# Altium schematic sheet Bank_12_14_35.SchDoc: Kasli-DIOT
size 420 x 297 mm; EDA_Number: ARTIQ; Projet: ARTIQ/SINARA; Author: G.Kasprowicz; CompanyName: WUT ISE; DrawnBy: F.Świtakowski; Organization: WUT ISE; Address1: PW ISE; Address2: Nowowiejska 15/19 00-665 Warsaw; Address3: gkasprow@gmail.com; DocumentNumber: 12; SheetNumber: 15; SheetTotal: 16; ModifiedBy: -; CheckedDate: -; Title2: Bank 12 14 35; DivGrp: WUT ISE; Designer: F.Świtakowski; ModifiedDate: -; ProjectName: Sensor Box
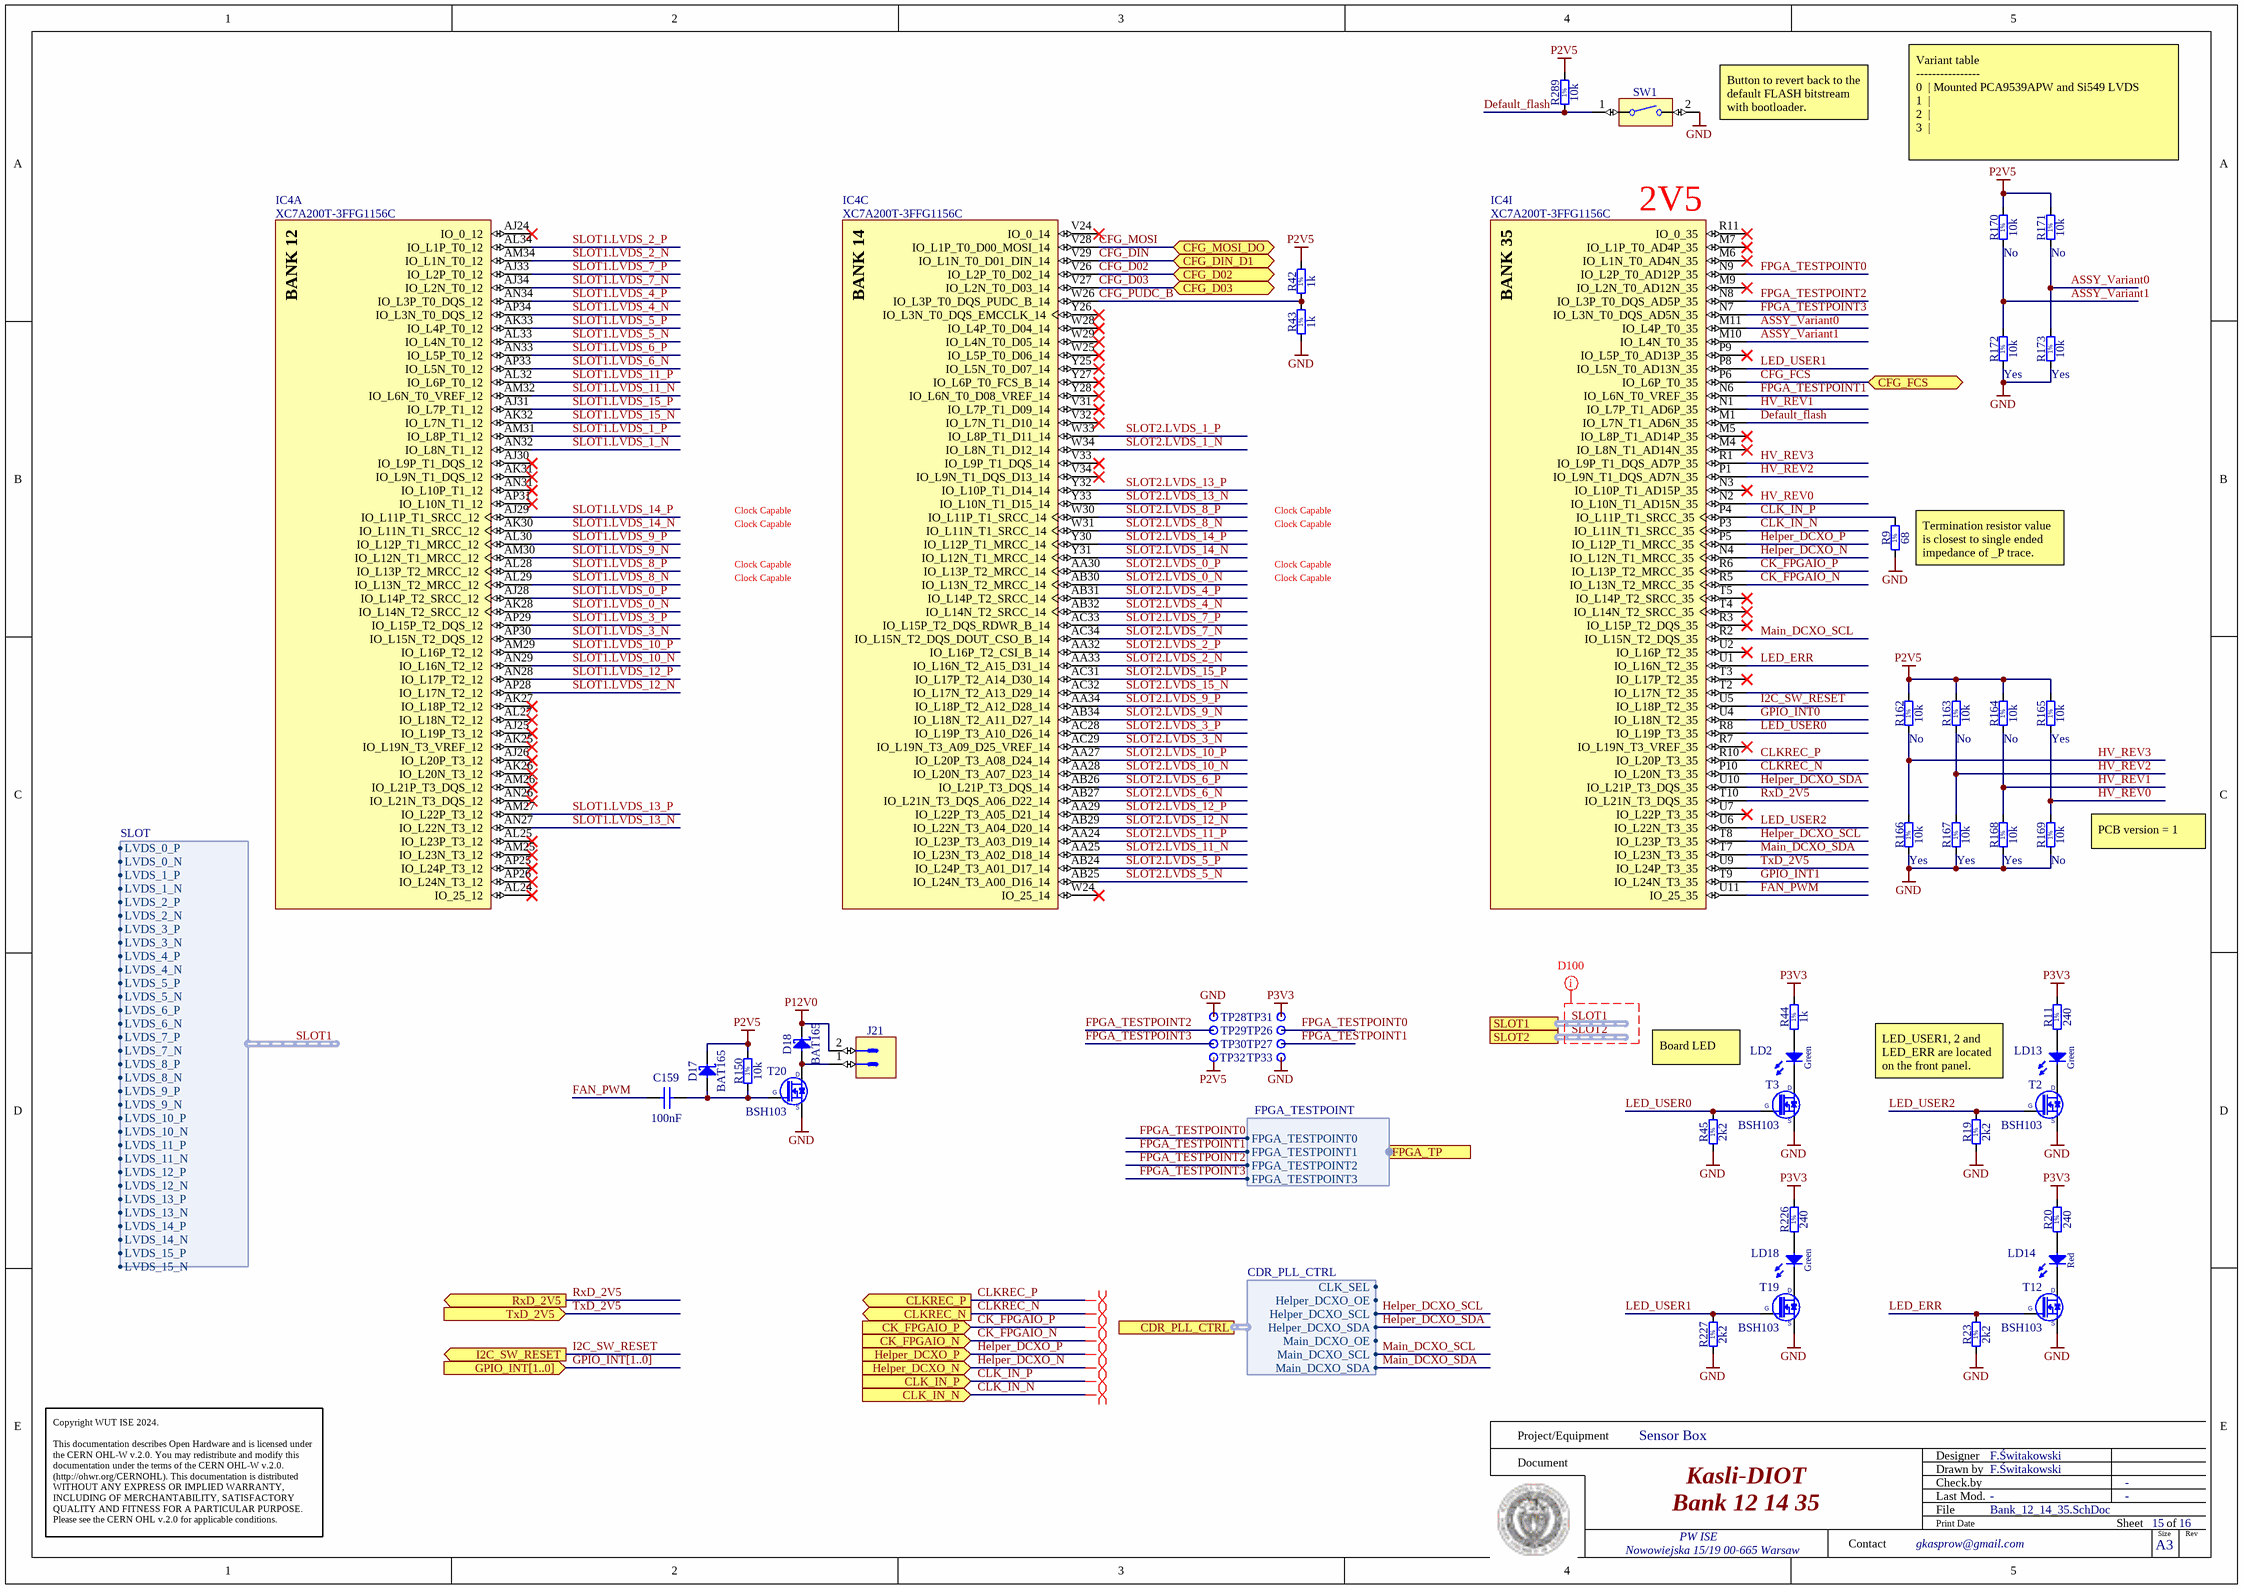
[diagram p0: Bank_12_14_35.SchDoc]

## Parts
C159  100nF  [CAPC0603X33N]
D17  BAT165  [SOD2512X110N]
D18  BAT165  [SOD2512X110N]
IC4  XC7A200T-3FFG1156C  [BGA1156C100P34X34_3500X3500X310]  (parts A,C,I of 18)
J21  KK®  [MOLEX_22-27-2021]  (value not drawn)
LD2  Green  [LED_KINGBRIGHT_KPH-1608CGCK]
LD13  Green  [LED_AVAGO_HSME-C120]
LD14  Red  [LED_AVAGO_HSMC-C120]
LD18  Green  [LED_AVAGO_HSME-C120]
R9  68  [RESC1005X40N]
R11  240  [RESC1005X40N]
R19  2k2  [RESC1005X40N]
R20  240  [RESC1005X40N]
R23  2k2  [RESC1005X40N]
R42  1k  [RESC1005X40N]
R43  1k  [RESC1005X40N]
R44  1k  [RESC1005X40N]
R45  2k2  [RESC1005X40N]
R150  10k  [RESC1005X40N]
R162  10k  Mounted: No  [RESC1005X40N]
R163  10k  Mounted: No  [RESC1005X40N]
R164  10k  Mounted: No  [RESC1005X40N]
R165  10k  Mounted: Yes  [RESC1005X40N]
R166  10k  Mounted: Yes  [RESC1005X40N]
R167  10k  Mounted: Yes  [RESC1005X40N]
R168  10k  Mounted: Yes  [RESC1005X40N]
R169  10k  Mounted: No  [RESC1005X40N]
R170  10k  Mounted: No  [RESC1005X40N]
R171  10k  Mounted: No  [RESC1005X40N]
R172  10k  Mounted: Yes  [RESC1005X40N]
R173  10k  Mounted: Yes  [RESC1005X40N]
R226  240  [RESC1005X40N]
R227  2k2  [RESC1005X40N]
R289  10k  [RESC1005X40N]
SW1  Switch  [SW_OMRON_B3U-3000PM]  (value not drawn)
T2  BSH103  [SOT95P230X110-3N]
T3  BSH103  [SOT95P230X110-3N]
T12  BSH103  [SOT95P230X110-3N]
T19  BSH103  [SOT95P230X110-3N]
T20  BSH103  [SOT95P230X110-3N]
TP26  Plated Hole  [c170h100]  (value not drawn)  (no BOM)
TP27  Plated Hole  [c170h100]  (value not drawn)  (no BOM)
TP28  Plated Hole  [c170h100]  (value not drawn)  (no BOM)
TP29  Plated Hole  [c170h100]  (value not drawn)  (no BOM)
TP30  Plated Hole  [c170h100]  (value not drawn)  (no BOM)
TP31  Plated Hole  [c170h100]  (value not drawn)  (no BOM)
TP32  Plated Hole  [c170h100]  (value not drawn)  (no BOM)
TP33  Plated Hole  [c170h100]  (value not drawn)  (no BOM)

## Ports
CDR_PLL_CTRL (harness CDR_PLL_CTRL), CFG_D02 (bidir), CFG_D03 (bidir), CFG_DIN_D1 (bidir), CFG_FCS (bidir), CFG_MOSI_DO (bidir), CK_FPGAIO_N (in), CK_FPGAIO_P (in), CLK_IN_N (in), CLK_IN_P (in), CLKREC_N (out), CLKREC_P (out), FPGA_TP (harness FPGA_TESTPOINT), GPIO_INT[1..0] (in), Helper_DCXO_N (in), Helper_DCXO_P (in), I2C_SW_RESET (out), RxD_2V5 (out), SLOT1 (harness SLOT), SLOT2 (harness SLOT), TxD_2V5 (in)

## Harnesses
CDR_PLL_CTRL: CLK_SEL, Helper_DCXO_OE, Helper_DCXO_SCL, Helper_DCXO_SDA, Main_DCXO_OE, Main_DCXO_SCL, Main_DCXO_SDA
SLOT: LVDS_0_P, LVDS_0_N, LVDS_1_P, LVDS_1_N, LVDS_2_P, LVDS_2_N, LVDS_3_P, LVDS_3_N, LVDS_4_P, LVDS_4_N, LVDS_5_P, LVDS_5_N, LVDS_6_P, LVDS_6_N, LVDS_7_P, LVDS_7_N, LVDS_8_P, LVDS_8_N, LVDS_9_P, LVDS_9_N, LVDS_10_P, LVDS_10_N, LVDS_11_P, LVDS_11_N, LVDS_12_P, LVDS_12_N, LVDS_13_P, LVDS_13_N, LVDS_14_P, LVDS_14_N, LVDS_15_P, LVDS_15_N
FPGA_TESTPOINT: FPGA_TESTPOINT0, FPGA_TESTPOINT1, FPGA_TESTPOINT2, FPGA_TESTPOINT3

## Nets
GND: R9.1 R19.1 R23.1 R43.1 R45.1 R166.1 R167.1 R168.1 R169.1 R172.1 R173.1 R227.1 SW1.2 T2.2(S) T3.2(S) T12.2(S) T19.2(S) T20.2(S) TP28.1 TP33.1
P2V5: D17.1(C) R42.2 R150.2 R162.2 R163.2 R164.2 R165.2 R170.2 R171.2 R289.2 TP32.1
P3V3: R11.2 R20.2 R44.2 R226.2 TP31.1
P12V0: D18.1(C) J21.2
ASSY_Variant0: IC4.M11(IO_L4P_T0_35) R171.1 R173.2
ASSY_Variant1: IC4.M10(IO_L4N_T0_35) R170.1 R172.2
CFG_D02: IC4.V26(IO_L2P_T0_D02_14) ; port CFG_D02
CFG_D03: IC4.V27(IO_L2N_T0_D03_14) ; port CFG_D03
CFG_DIN: IC4.V29(IO_L1N_T0_D01_DIN_14) ; port CFG_DIN_D1
CFG_FCS: IC4.P6(IO_L6P_T0_35) ; port CFG_FCS
CFG_MOSI: IC4.V28(IO_L1P_T0_D00_MOSI_14) ; port CFG_MOSI_DO
CFG_PUDC_B: IC4.W26(IO_L3P_T0_DQS_PUDC_B_14) R42.1 R43.2
CK_FPGAIO_N: IC4.R5(IO_L13N_T2_MRCC_35) ; port CK_FPGAIO_N
CK_FPGAIO_P: IC4.R6(IO_L13P_T2_MRCC_35) ; port CK_FPGAIO_P
CLK_IN_N: IC4.P3(IO_L11N_T1_SRCC_35) ; port CLK_IN_N
CLK_IN_P: IC4.P4(IO_L11P_T1_SRCC_35) R9.2 ; port CLK_IN_P
CLKREC_N: IC4.P10(IO_L20N_T3_35) ; port CLKREC_N
CLKREC_P: IC4.R10(IO_L20P_T3_35) ; port CLKREC_P
Default_flash: IC4.M1(IO_L7N_T1_AD6N_35) R289.1 SW1.1
FAN_PWM: C159.2 IC4.U11(IO_25_35)
FPGA_TESTPOINT0: IC4.N9(IO_L2P_T0_AD12P_35) TP26.1 ; port FPGA_TP.FPGA_TESTPOINT0
FPGA_TESTPOINT1: IC4.N6(IO_L6N_T0_VREF_35) TP27.1 ; port FPGA_TP.FPGA_TESTPOINT1
FPGA_TESTPOINT2: IC4.N8(IO_L3P_T0_DQS_AD5P_35) TP29.1 ; port FPGA_TP.FPGA_TESTPOINT2
FPGA_TESTPOINT3: IC4.N7(IO_L3N_T0_DQS_AD5N_35) TP30.1 ; port FPGA_TP.FPGA_TESTPOINT3
GPIO_INT0: IC4.U4(IO_L18N_T2_35)
GPIO_INT1: IC4.T9(IO_L24N_T3_35)
Helper_DCXO_N: IC4.N4(IO_L12N_T1_MRCC_35) ; port Helper_DCXO_N
Helper_DCXO_P: IC4.P5(IO_L12P_T1_MRCC_35) ; port Helper_DCXO_P
Helper_DCXO_SCL: IC4.T8(IO_L23P_T3_35) ; port CDR_PLL_CTRL.Helper_DCXO_SCL
Helper_DCXO_SDA: IC4.U10(IO_L21P_T3_DQS_35) ; port CDR_PLL_CTRL.Helper_DCXO_SDA
HV_REV0: IC4.N2(IO_L10N_T1_AD15N_35) R165.1 R169.2
HV_REV1: IC4.N1(IO_L7P_T1_AD6P_35) R164.1 R168.2
HV_REV2: IC4.P1(IO_L9N_T1_DQS_AD7N_35) R163.1 R167.2
HV_REV3: IC4.R1(IO_L9P_T1_DQS_AD7P_35) R162.1 R166.2
I2C_SW_RESET: IC4.U5(IO_L18P_T2_35) ; port I2C_SW_RESET
LED_ERR: IC4.U1(IO_L16N_T2_35) R23.2 T12.1(G)
LED_USER0: IC4.R8(IO_L19P_T3_35) R45.2 T3.1(G)
LED_USER1: IC4.P8(IO_L5N_T0_AD13N_35) R227.2 T19.1(G)
LED_USER2: IC4.U6(IO_L22N_T3_35) R19.2 T2.1(G)
Main_DCXO_SCL: IC4.R2(IO_L15N_T2_DQS_35) ; port CDR_PLL_CTRL.Main_DCXO_SCL
Main_DCXO_SDA: IC4.T7(IO_L23N_T3_35) ; port CDR_PLL_CTRL.Main_DCXO_SDA
RxD_2V5: IC4.T10(IO_L21N_T3_DQS_35) ; port RxD_2V5
SLOT1.LVDS_0_N: IC4.AK28(IO_L14N_T2_SRCC_12)
SLOT1.LVDS_0_P: IC4.AJ28(IO_L14P_T2_SRCC_12)
SLOT1.LVDS_1_N: IC4.AN32(IO_L8N_T1_12)
SLOT1.LVDS_1_P: IC4.AM31(IO_L8P_T1_12)
SLOT1.LVDS_2_N: IC4.AM34(IO_L1N_T0_12)
SLOT1.LVDS_2_P: IC4.AL34(IO_L1P_T0_12)
SLOT1.LVDS_3_N: IC4.AP30(IO_L15N_T2_DQS_12)
SLOT1.LVDS_3_P: IC4.AP29(IO_L15P_T2_DQS_12)
SLOT1.LVDS_4_N: IC4.AP34(IO_L3N_T0_DQS_12)
SLOT1.LVDS_4_P: IC4.AN34(IO_L3P_T0_DQS_12)
SLOT1.LVDS_5_N: IC4.AL33(IO_L4N_T0_12)
SLOT1.LVDS_5_P: IC4.AK33(IO_L4P_T0_12)
SLOT1.LVDS_6_N: IC4.AP33(IO_L5N_T0_12)
SLOT1.LVDS_6_P: IC4.AN33(IO_L5P_T0_12)
SLOT1.LVDS_7_N: IC4.AJ34(IO_L2N_T0_12)
SLOT1.LVDS_7_P: IC4.AJ33(IO_L2P_T0_12)
SLOT1.LVDS_8_N: IC4.AL29(IO_L13N_T2_MRCC_12)
SLOT1.LVDS_8_P: IC4.AL28(IO_L13P_T2_MRCC_12)
SLOT1.LVDS_9_N: IC4.AM30(IO_L12N_T1_MRCC_12)
SLOT1.LVDS_9_P: IC4.AL30(IO_L12P_T1_MRCC_12)
SLOT1.LVDS_10_N: IC4.AN29(IO_L16N_T2_12)
SLOT1.LVDS_10_P: IC4.AM29(IO_L16P_T2_12)
SLOT1.LVDS_11_N: IC4.AM32(IO_L6N_T0_VREF_12)
SLOT1.LVDS_11_P: IC4.AL32(IO_L6P_T0_12)
SLOT1.LVDS_12_N: IC4.AP28(IO_L17N_T2_12)
SLOT1.LVDS_12_P: IC4.AN28(IO_L17P_T2_12)
SLOT1.LVDS_13_N: IC4.AN27(IO_L22N_T3_12)
SLOT1.LVDS_13_P: IC4.AM27(IO_L22P_T3_12)
SLOT1.LVDS_14_N: IC4.AK30(IO_L11N_T1_SRCC_12)
SLOT1.LVDS_14_P: IC4.AJ29(IO_L11P_T1_SRCC_12)
SLOT1.LVDS_15_N: IC4.AK32(IO_L7N_T1_12)
SLOT1.LVDS_15_P: IC4.AJ31(IO_L7P_T1_12)
SLOT2.LVDS_0_N: IC4.AB30(IO_L13N_T2_MRCC_14)
SLOT2.LVDS_0_P: IC4.AA30(IO_L13P_T2_MRCC_14)
SLOT2.LVDS_1_N: IC4.W34(IO_L8N_T1_D12_14)
SLOT2.LVDS_1_P: IC4.W33(IO_L8P_T1_D11_14)
SLOT2.LVDS_2_N: IC4.AA33(IO_L16N_T2_A15_D31_14)
SLOT2.LVDS_2_P: IC4.AA32(IO_L16P_T2_CSI_B_14)
SLOT2.LVDS_3_N: IC4.AC29(IO_L19N_T3_A09_D25_VREF_14)
SLOT2.LVDS_3_P: IC4.AC28(IO_L19P_T3_A10_D26_14)
SLOT2.LVDS_4_N: IC4.AB32(IO_L14N_T2_SRCC_14)
SLOT2.LVDS_4_P: IC4.AB31(IO_L14P_T2_SRCC_14)
SLOT2.LVDS_5_N: IC4.AB25(IO_L24N_T3_A00_D16_14)
SLOT2.LVDS_5_P: IC4.AB24(IO_L24P_T3_A01_D17_14)
SLOT2.LVDS_6_N: IC4.AB27(IO_L21N_T3_DQS_A06_D22_14)
SLOT2.LVDS_6_P: IC4.AB26(IO_L21P_T3_DQS_14)
SLOT2.LVDS_7_N: IC4.AC34(IO_L15N_T2_DQS_DOUT_CSO_B_14)
SLOT2.LVDS_7_P: IC4.AC33(IO_L15P_T2_DQS_RDWR_B_14)
SLOT2.LVDS_8_N: IC4.W31(IO_L11N_T1_SRCC_14)
SLOT2.LVDS_8_P: IC4.W30(IO_L11P_T1_SRCC_14)
SLOT2.LVDS_9_N: IC4.AB34(IO_L18N_T2_A11_D27_14)
SLOT2.LVDS_9_P: IC4.AA34(IO_L18P_T2_A12_D28_14)
SLOT2.LVDS_10_N: IC4.AA28(IO_L20N_T3_A07_D23_14)
SLOT2.LVDS_10_P: IC4.AA27(IO_L20P_T3_A08_D24_14)
SLOT2.LVDS_11_N: IC4.AA25(IO_L23N_T3_A02_D18_14)
SLOT2.LVDS_11_P: IC4.AA24(IO_L23P_T3_A03_D19_14)
SLOT2.LVDS_12_N: IC4.AB29(IO_L22N_T3_A04_D20_14)
SLOT2.LVDS_12_P: IC4.AA29(IO_L22P_T3_A05_D21_14)
SLOT2.LVDS_13_N: IC4.Y33(IO_L10N_T1_D15_14)
SLOT2.LVDS_13_P: IC4.Y32(IO_L10P_T1_D14_14)
SLOT2.LVDS_14_N: IC4.Y31(IO_L12N_T1_MRCC_14)
SLOT2.LVDS_14_P: IC4.Y30(IO_L12P_T1_MRCC_14)
SLOT2.LVDS_15_N: IC4.AC32(IO_L17N_T2_A13_D29_14)
SLOT2.LVDS_15_P: IC4.AC31(IO_L17P_T2_A14_D30_14)
TxD_2V5: IC4.U9(IO_L24P_T3_35) ; port TxD_2V5
NetC159_1: C159.1 D17.2(A) R150.1 T20.1(G)
NetD18_2: D18.2(A) J21.1 T20.3(D)
NetLD2_1: LD2.1(C) T3.3(D)
NetLD2_2: LD2.2(A) R44.1
NetLD13_1: LD13.1(C) T2.3(D)
NetLD13_2: LD13.2(A) R11.1
NetLD14_1: LD14.1(C) T12.3(D)
NetLD14_2: LD14.2(A) R20.1
NetLD18_1: LD18.1(C) T19.3(D)
NetLD18_2: LD18.2(A) R226.1

Not connected (* = marked no-connect by the designer): IC4 AJ24(IO_0_12)* AJ25(IO_L19P_T3_12)* AJ26(IO_L20P_T3_12)* AJ30(IO_L9P_T1_DQS_12)* AK25(IO_L19N_T3_VREF_12)* AK26(IO_L20N_T3_12)* AK27(IO_L18P_T2_12)* AK31(IO_L9N_T1_DQS_12)* AL24(IO_25_12)* AL25(IO_L23P_T3_12)* AL27(IO_L18N_T2_12)* AM25(IO_L23N_T3_12)* AM26(IO_L21P_T3_DQS_12)* AN26(IO_L21N_T3_DQS_12)* AN31(IO_L10P_T1_12)* AP25(IO_L24P_T3_12)* AP26(IO_L24N_T3_12)* AP31(IO_L10N_T1_12)* M4(IO_L8N_T1_AD14N_35)* M5(IO_L8P_T1_AD14P_35)* M6(IO_L1N_T0_AD4N_35)* M7(IO_L1P_T0_AD4P_35)* M9(IO_L2N_T0_AD12N_35)* N3(IO_L10P_T1_AD15P_35)* P9(IO_L5P_T0_AD13P_35)* R3(IO_L15P_T2_DQS_35)* R7(IO_L19N_T3_VREF_35)* R11(IO_0_35)* T2(IO_L17N_T2_35) T3(IO_L17P_T2_35)* T4(IO_L14N_T2_SRCC_35)* T5(IO_L14P_T2_SRCC_35)* U2(IO_L16P_T2_35)* U7(IO_L22P_T3_35)* V24(IO_0_14)* V31(IO_L7P_T1_D09_14)* V32(IO_L7N_T1_D10_14)* V33(IO_L9P_T1_DQS_14)* V34(IO_L9N_T1_DQS_D13_14)* W24(IO_25_14)* W25(IO_L5P_T0_D06_14)* W28(IO_L4P_T0_D04_14)* W29(IO_L4N_T0_D05_14)* Y25(IO_L5N_T0_D07_14)* Y26(IO_L3N_T0_DQS_EMCCLK_14)* Y27(IO_L6P_T0_FCS_B_14)* Y28(IO_L6N_T0_D08_VREF_14)*

## Buses and harness runs
bus GPIO_INT[1..0] = port GPIO_INT[1..0]
harness SLOT1 = port SLOT1
harness SLOT2 = port SLOT2

## Layout directives
differential pair: CK_FPGAIO_N, CK_FPGAIO_P, CLK_IN_N, CLK_IN_P, CLKREC_N, CLKREC_P, Helper_DCXO_N, Helper_DCXO_P
net class D100: SLOT1, SLOT2

## Notes on the sheet
- (near SW1) Button to revert back to the default FLASH bitstream with bootloader.
- Variant table
  ----------------
  0  | Mounted PCA9539APW and Si549 LVDS
  1  |
  2  |
  3  |
- (near IC4) 2V5
- Clock Capable
- (near R9) Termination resistor value is closest to single ended impedance of _P trace.
- (near R169) PCB version = 1
- Board LED
- LED_USER1, 2 and LED_ERR are located on the front panel.
- Project/Equipment
- Document
- Designer
- Drawn by
- Check.by
- Copyright WUT ISE 2024.
  This documentation describes Open Hardware and is licensed under the CERN OHL-W v.2.0. You may redistribute and modify this documentation under the terms of the CERN OHL-W v.2.0. (http://ohwr.org/CERNOHL). This documentation is distributed WITHOUT ANY EXPRESS OR IMPLIED WARRANTY, INCLUDING OF MERCHANTABILITY, SATISFACTORY QUALITY AND FITNESS FOR A PARTICULAR PURPOSE. Please see the CERN OHL v.2.0 for applicable conditions.
- Contact
- File
- Last Mod.
- Print Date
- Sheet
- Size
- A3
- of
- Rev
- (in symbol R0402_1K_1%_0.0625W_100PPM) 1%
- (in symbol R0402_1k_1%_0.0625W_100PPM) 1%
- (in symbol R0402_2K2_1%_0.0625W_100PPM) 1%
- (in symbol R0402_10k_1%_0.0625W_100PPM) 1%
- (in symbol R0402_68R_1%_0.0625W_100PPM) 1%
- (in symbol R0402_240R_1%_0.0625W_100PPM) 1%
- (in symbol XC7A200T-3FFG1156C, part A) BANK 12
- (in symbol XC7A200T-3FFG1156C, part C) BANK 14
- (in symbol XC7A200T-3FFG1156C, part I) BANK 35

## Library data of the parts
C159 = CC0201_100NF_6.3V_10%_X5R: Non-polarised capacitor; Part Description: SMD Multilayer Chip Ceramic Capacitor; Manufacturer: GENERIC; Manufacturer1 Part Number: 02016D104KAT2A; Voltage: 6.3V; TC: X5R; Tolerance: ±10%; Part Number: CC0201_100NF_6.3V_10%_X5R; Component Kind: Standard; Component Type: Standard; Pin Count: 2; Value: 100nF; Status: Not Recommended; Manufacturer Part Number: CC0201_100NF_6.3V_10%_X5R; Case: 0201; Mounted: Yes; Socket: No; SMD: Yes; Sense: No; Manufacturer1 Example: AVX; Manufacturer1 ComponentHeight: 0.33mm; HelpURL: \\cern.ch\dfs\Applications\Altium\Datasheets\CC0201_X5R_AVX.pdf; Author: CERN DEM JLC; CreateDate: 2007-12-03; LatestRevisionDate: 2007-12-03; ClassName: FPGA_JTAG
D17 D18 = BAT165: Schottky Diode; Part Description: Medium Power AF Schottky Diode; Manufacturer: INFINEON; Voltage: 40V; Power: 750mA; PressFit: No; Bonding: No; Part Number: BAT165; Component Kind: Standard; Component Type: Standard; Device: BAT165; PackageDescription: Small Outline Diode (SOD-323), 1.70mm W X 1.25mm L X 1.10mm H body,  IPC Medium Density; Manufacturer Part Number: BAT165; Pin Count: 2; Case: SOD323; Mounted: Yes; Socket: No; SMD: Yes; Sense: No; ComponentHeight: 1.1mm; HelpURL: \\cern.ch\dfs\Applications\Altium\Datasheets\BAT165.pdf; Author: CERN DEM JLC; CreateDate: 12.11.2014; LatestRevisionDate: 12.11.2014
IC4 = XC7A200T-3FFG1156C: Artix-7 FPGA, 500 User I/Os, 16 GTP, 1156-Ball BGA, , Speed Grade 3, Commercial Grade, Pb-Free; Part Description: Artix-7 FPGA, 500 User I/Os, 16 GTP, 1156-Ball BGA, Speed Grade 3, Commercial Grade, Pb-Free; Manufacturer: XILINX; PressFit: No; Bonding: No; Part Number: XC7A200T-3FFG1156C; Component Kind: Standard; Component Type: Standard; Device: XC7A200T-3FFG1156C; PackageDescription: BGA, 1.00mm Pitch, Square; 1156 Pin, 34 Columns X 34 Rows, Body 35.00mm X 35.0mm X 3.10mm H, IPC Medium Density; Manufacturer Part Number: XC7A200T-3FFG1156C; Pin Count: 1156; Case: BGA1156; Mounted: Yes; Socket: No; SMD: Yes; Sense: No; ComponentHeight: 3.1mm; HelpURL: \\cern.ch\dfs\Applications\Altium\Datasheets\XC7A200T-3FFG1156C.pdf; ComponentLink1URL: \\cern.ch\dfs\Applications\Altium\Datasheets\XC7A200T-3FFG1156C_Package.pdf; ComponentLink1Description: Package; ComponentLink2URL: \\cern.ch\dfs\Applications\Altium\Datasheets\XC7A200T-3FFG1156C_Pinout.txt; ComponentLink2Description: Pinout; Author: CERN DEM JLC; CreateDate: 07.11.2016; LatestRevisionDate: 07.11.2016
J21 = MOLEX_22-27-2021: Connector 2 Male; Part Description: 2.54mm (.100") Pitch KK® Wire-to-Board Header, Vertical, with Friction Lock, 2 Circuits, Tin (Sn) Plating; Manufacturer: MOLEX; PressFit: No; Part Number: MOLEX_22-27-2021; Component Kind: Standard; Component Type: Standard; Pin Count: 2; Family: KK®; Mounted: Yes; Socket: No; SMD: No; Sense: No; Status: None; Manufacturer Part Number: 22-27-2021; ComponentHeight: 11.7mm; HelpURL: \\cern.ch\dfs\Applications\Altium\Datasheets\MOLEX_22-27-2021.pdf; Author: CERN DEM JLC; CreateDate: 04.12.2008; LatestRevisionDate: 04.12.2008
LD2 = LED_KINGBRIGHT_KPH-1608CGCK: LED Green 1C 2A; Part Description: SMD Green LED, Case 1.6mmX0.8mm(0603), 0.65mm Thickness; PressFit: No; Bonding: No; Manufacturer Part Number: KPH-1608CGCK; ComponentHeight: 0.65mm; HelpURL: \\cern.ch\dfs\Applications\Altium\Datasheets\LED_KINGBRIGHT_KPH-1608CGCK.pdf; Part Number: LED_KINGBRIGHT_KPH-1608CGCK; Component Kind: Standard; Component Type: Standard; Color: Green; PackageDescription: SMT Green LED, Case 0603, Body L 1.6 x W 0.8mm H 0.65mm; Manufacturer: KINGBRIGHT; Pin Count: 2; Mounted: Yes; Socket: No; SMD: Yes; Sense: No; Author: CERN DEM JLC; CreateDate: 03.07.2017; LatestRevisionDate: 03.07.2017
LD13 LD18 = LED_AVAGO_HSME-C120: LED Green 1C 2A; Part Description: High Performance Right Angle Chip Green LED; Manufacturer: AVAGO TECHNOLOGIES; PressFit: No; Bonding: No; Manufacturer Part Number: HSME-C120; ComponentHeight: 0.7mm; HelpURL: \\cern.ch\dfs\Applications\Altium\Datasheets\LED_AVAGO_HSME-C120.pdf; Part Number: LED_AVAGO_HSME-C120; Component Kind: Standard; Component Type: Standard; Color: Green; PackageDescription: Green Chip LED, 2-Leads, Body 1.7x1.1mm, Side Emitting Package; Pin Count: 2; Mounted: Yes; Socket: No; SMD: Yes; Sense: No; Author: CERN DEM JMW; CreateDate: 22.07.2009; LatestRevisionDate: 20.06.2012; ComponentLink1URL: \\cern.ch\dfs\Applications\Altium\Datasheets\LED_AVAGO_HSME-C110_DESIGN-GUIDE.pdf; ComponentLink1Description: Design Guide
LD14 = LED_AVAGO_HSMC-C120: LED Red 1C 2A; Part Description: High Performance Right Angle Chip Red LED; Manufacturer: AVAGO TECHNOLOGIES; PressFit: No; Bonding: No; Manufacturer Part Number: HSMC-C120; ComponentHeight: 0.7mm; HelpURL: \\cern.ch\dfs\Applications\Altium\Datasheets\LED_AVAGO_HSMC-C120.pdf; Part Number: LED_AVAGO_HSMC-C120; Component Kind: Standard; Component Type: Standard; Color: Red; PackageDescription: Red Chip LED, 2-Leads, Body 1.7x1.1mm, Side Emitting Package; Pin Count: 2; Mounted: Yes; Socket: No; SMD: Yes; Sense: No; Author: CERN DEM JMW; CreateDate: 2009-07-22; LatestRevisionDate: 2012-06-20; ComponentLink1URL: \\cern.ch\dfs\Applications\Altium\Datasheets\LED_AVAGO_HSMC-C120_DESIGN-GUIDE.pdf; ComponentLink1Description: Design Guide
R9 = R0402_68R_1%_0.0625W_100PPM: Resistor - 1%; Part Description: General Purpose Thick Film Chip Resistor; Manufacturer: GENERIC; Manufacturer1 Part Number: 232270676809L; TC: ±100ppm/°C; PressFit: No; Part Number: R0402_68R_1%_0.0625W_100PPM; Component Kind: Standard; Component Type: Standard; Pin Count: 2; Value: 68; Status: Not Recommended; Power: 0.0625W; Tolerance: ±1%; Manufacturer Part Number: R0402_68R_1%_0.0625W_100PPM; Case: 0402; Mounted: Yes; Sense: No; Socket: No; SMD: Yes; Manufacturer1 Example: YAGEO PHYCOMP; Manufacturer1 ComponentHeight: 0.4mm; HelpURL: \\cern.ch\dfs\Applications\Altium\Datasheets\R0402_Phycomp_RC0402.pdf; Author: CERN DEM JLC; CreateDate: 03.12.2007; LatestRevisionDate: 17.10.2012
R11 R20 R226 = R0402_240R_1%_0.0625W_100PPM: Resistor - 1%; Part Description: General Purpose Thick Film Chip Resistor; Manufacturer: GENERIC; Manufacturer1 Part Number: 232270672401L; TC: ±100ppm/°C; PressFit: No; Part Number: R0402_240R_1%_0.0625W_100PPM; Component Kind: Standard; Component Type: Standard; Pin Count: 2; Value: 240; Status: Not Recommended; Power: 0.0625W; Tolerance: ±1%; Manufacturer Part Number: R0402_240R_1%_0.0625W_100PPM; Case: 0402; Mounted: Yes; Sense: No; Socket: No; SMD: Yes; Manufacturer1 Example: YAGEO PHYCOMP; Manufacturer1 ComponentHeight: 0.4mm; HelpURL: \\cern.ch\dfs\Applications\Altium\Datasheets\R0402_Phycomp_RC0402.pdf; Author: CERN DEM JLC; CreateDate: 03.12.2007; LatestRevisionDate: 17.10.2012
R19 R23 R45 R227 = R0402_2K2_1%_0.0625W_100PPM: Resistor - 1%; Part Description: General Purpose Thick Film Chip Resistor; Manufacturer: GENERIC; Manufacturer1 Part Number: 232270672202L; TC: ±100ppm/°C; PressFit: No; Part Number: R0402_2K2_1%_0.0625W_100PPM; Component Kind: Standard; Component Type: Standard; Pin Count: 2; Value: 2k2; Status: Not Recommended; Power: 0.0625W; Tolerance: ±1%; Manufacturer Part Number: R0402_2K2_1%_0.0625W_100PPM; Case: 0402; Mounted: Yes; Sense: No; Socket: No; SMD: Yes; Manufacturer1 Example: YAGEO PHYCOMP; Manufacturer1 ComponentHeight: 0.4mm; HelpURL: \\cern.ch\dfs\Applications\Altium\Datasheets\R0402_Phycomp_RC0402.pdf; Author: CERN DEM JLC; CreateDate: 03.12.2007; LatestRevisionDate: 17.10.2012; ClassName: Artix
R42 R43 = R0402_1K_1%_0.0625W_100PPM: Resistor - 1%; Part Description: General Purpose Thick Film Chip Resistor; Manufacturer: GENERIC; Manufacturer1 Part Number: 232270671002L; TC: ±100ppm/°C; PressFit: No; Part Number: R0402_1K_1%_0.0625W_100PPM; Component Kind: Standard; Component Type: Standard; Pin Count: 2; Value: 1k; Status: Not Recommended; Power: 0.0625W; Tolerance: ±1%; Manufacturer Part Number: R0402_1K_1%_0.0625W_100PPM; Case: 0402; Mounted: Yes; Sense: No; Socket: No; SMD: Yes; Manufacturer1 Example: YAGEO PHYCOMP; Manufacturer1 ComponentHeight: 0.4mm; HelpURL: \\cern.ch\dfs\Applications\Altium\Datasheets\R0402_Phycomp_RC0402.pdf; Author: CERN DEM JLC; CreateDate: 03.12.2007; LatestRevisionDate: 17.10.2012; ClassName: Artix
R44 = R0402_1k_1%_0.0625W_100PPM: Resistor - 1%; Part Description: General Purpose Thick Film Chip Resistor; Manufacturer: GENERIC; Manufacturer1 Part Number: 232270671002L; TC: ±100ppm/°C; PressFit: No; Part Number: R0402_1K_1%_0.0625W_100PPM; Component Kind: Standard; Component Type: Standard; Pin Count: 2; Value: 1k; Status: Not Recommended; Power: 0.0625W; Tolerance: ±1%; Manufacturer Part Number: R0402_1K_1%_0.0625W_100PPM; Case: 0402; Mounted: Yes; Sense: No; Socket: No; SMD: Yes; Manufacturer1 Example: YAGEO PHYCOMP; Manufacturer1 ComponentHeight: 0.4mm; HelpURL: \\cern.ch\dfs\Applications\Altium\Datasheets\R0402_Phycomp_RC0402.pdf; Author: CERN DEM JLC; CreateDate: 03.12.2007; LatestRevisionDate: 17.10.2012; ClassName: Artix
R150 R162-R173 R289 = R0402_10k_1%_0.0625W_100PPM: Resistor - 1%; Part Description: General Purpose Thick Film Chip Resistor; Manufacturer: GENERIC; Manufacturer1 Part Number: 232270671003L; TC: ±100ppm/°C; PressFit: No; Part Number: R0402_10K_1%_0.0625W_100PPM; Component Kind: Standard; Component Type: Standard; Pin Count: 2; Value: 10k; Status: Not Recommended; Power: 0.0625W; Tolerance: ±1%; Manufacturer Part Number: R0402_10K_1%_0.0625W_100PPM; Case: 0402; Sense: No; Socket: No; SMD: Yes; Manufacturer1 Example: YAGEO PHYCOMP; Manufacturer1 ComponentHeight: 0.4mm; HelpURL: \\cern.ch\dfs\Applications\Altium\Datasheets\R0402_Phycomp_RC0402.pdf; Author: CERN DEM JLC; CreateDate: 03.12.2007; LatestRevisionDate: 17.10.2012
  R150 R289: Mounted: Yes
SW1 = SW_OMRON_B3U-3000PM: 1 Ways SPST DIP Switch; Part Description: Ultra-small Surface-mounting Tactile Switche with High Contact Reliability, Side-actuated, Contact Rating 50mA 12VDC; Manufacturer: OMRON; PressFit: No; Sense Comment: Non-washable; Part Number: SW_OMRON_B3U-3000PM; Component Kind: Standard; Component Type: Standard; Pin Count: 2; PackageDescription: Body 3.2x4.0mm, SPST Surface-Mounting Tactile Switch with Side Actuator (B3U Series); Family: Switch; Mounted: Yes; Socket: No; SMD: Yes; Sense: Yes; Status: None; Manufacturer Part Number: B3U-3000PM; ComponentHeight: 1.35mm; HelpURL: \\cern.ch\dfs\Applications\Altium\Datasheets\SW_OMRON_B3U.pdf; Author: CERN DEM HF; CreateDate: 04.10.2022; LatestRevisionDate: 04.10.2022
T2 T3 T12 T19 T20 = BSH103: N-CHANNEL MOSFET WITH DIODE; Part Description: 30V 850mA N-Channel Enhancement Mode Field-Effect Transistor; Manufacturer: NEXPERIA; PressFit: No; Bonding: No; Part Number: BSH103; Component Kind: Standard; Component Type: Standard; Device: BSH103; PackageDescription: SOT23, 3 pin, Pitch 0.95mm - 1.3mm W X 2.9mm L X 1.1mm H, IPC Medium Density; Manufacturer Part Number: BSH103; Pin Count: 3; Case: SOT23-3; Mounted: Yes; Socket: No; SMD: Yes; Sense: No; ComponentHeight: 1.1mm; HelpURL: \\cern.ch\dfs\Applications\Altium\Datasheets\BSH103.pdf; Author: CERN DEM JLC; CreateDate: 16.03.2010; LatestRevisionDate: 20.06.2017; ClassName: Artix
TP26-TP33 = PLATED_HOLE1.0_PAD1.7: Single Terminal Socket; Part Description: Plated Through Hole: Hole Dia.=1.0mm Pad Dia.=1.7mm,  IPC-7251 Level A; Mounted: No; Part Number: PLATED_HOLE1.0_PAD1.7; Component Type: Standard (No BOM); Pin Count: 1; Family: Plated Hole; Socket: No; SMD: No; Sense: No; Status: None; ComponentHeight: 0mm; HelpURL: Undefined; Author: CERN DEM JLC; CreateDate: 11.05.2017; LatestRevisionDate: 11.05.2017; PackageDescription: Plated Through Hole: Hole Dia.=1.0mm Pad Dia.=1.7mm,  IPC-7251 Level A